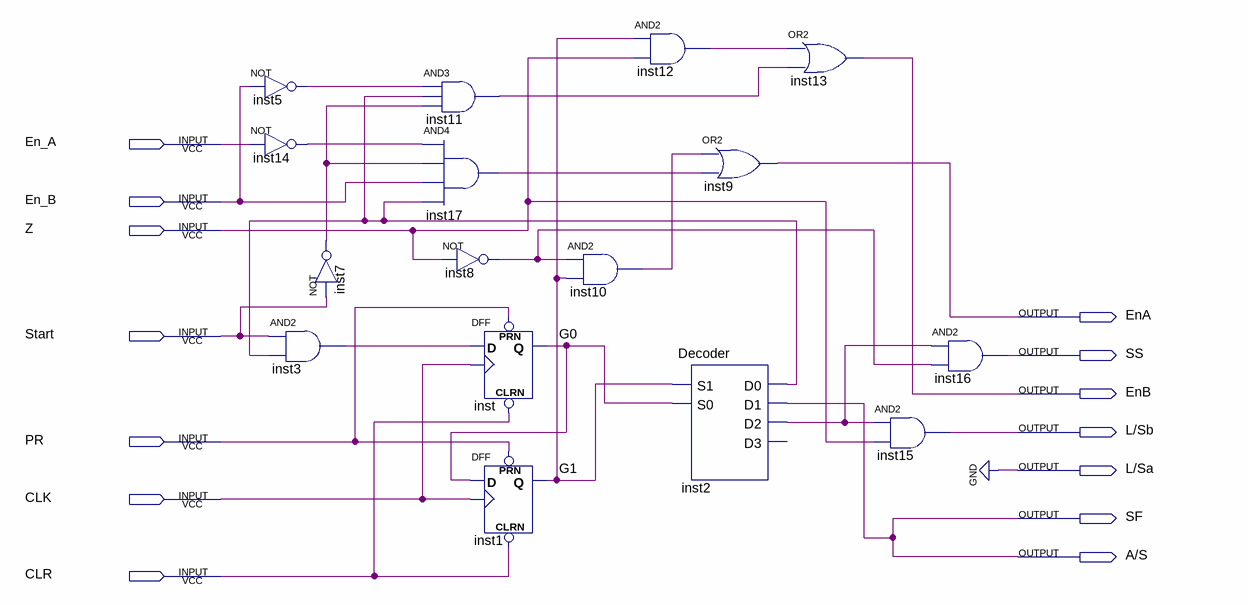
[diagram p0: schematic sheet]
// Quartus schematic Control_Unit.bdf as structural Verilog: 16 symbols, 14 pins
module Control_Unit (
  input  En_A,
  input  En_B,
  input  Z,
  input  Start,
  input  PR,
  input  CLK,
  input  CLR,
  output EnA,
  output SS,
  output EnB,
  output \L/Sb ,
  output \L/Sa ,
  output SF,
  output \A/S 
);

  wire G0, G1, inst2_d0, inst2_d2, inst3_out, inst5_out, inst7_out, inst8_out, inst10_out, inst11_out,
       inst12_out, inst14_out, inst17_out;

  not inst5 (inst5_out, En_B);
  not inst14 (inst14_out, En_A);
  not inst7 (inst7_out, Start);
  and inst3 (inst3_out, Start, inst2_d0);
  and inst11 (inst11_out, inst5_out, inst2_d0, inst7_out);
  and inst17 (inst17_out, inst14_out, inst7_out, En_B, inst2_d0);
  not inst8 (inst8_out, Z);
  DFF inst (.CLRN(CLR), .CLK(CLK), .D(inst3_out), .PRN(PR), .Q(G0));
  DFF inst1 (.CLRN(CLR), .CLK(CLK), .D(G0), .PRN(PR), .Q(G1));
  and inst10 (inst10_out, inst8_out, G1);
  and inst12 (inst12_out, G1, Z);
  or inst9 (EnA, inst10_out, inst17_out);
  Decoder inst2 (.S1(G1), .S0(G0), .D0(inst2_d0), .D1(\A/S ), .D2(inst2_d2));  // open: D3
  or inst13 (EnB, inst12_out, inst11_out);
  and inst16 (SS, inst2_d2, inst8_out);
  and inst15 (\L/Sb , inst2_d2, Z);

  assign \L/Sa  = 1'b0;
  assign SF = \A/S ;
endmodule
